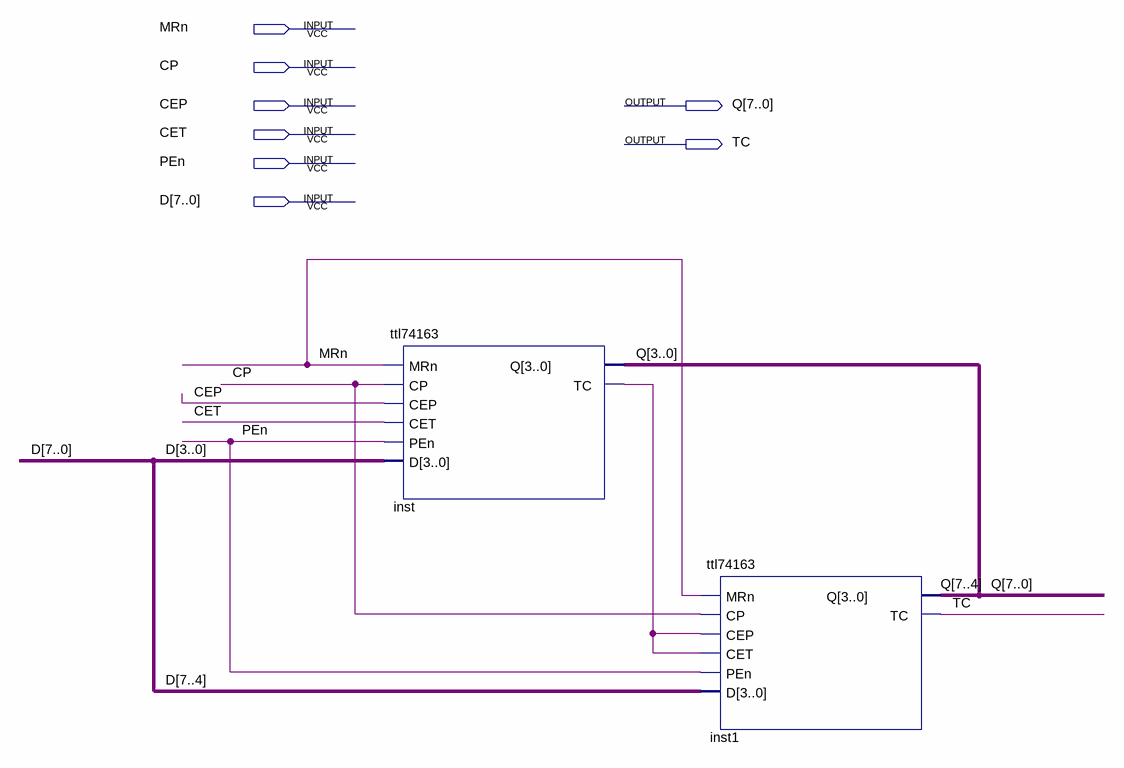
[diagram p0: schematic sheet]
// Quartus schematic bit8_counter.bdf as structural Verilog: 2 symbols, 8 pins
module bit8_counter (
  input  MRn,
  input  CP,
  input  CEP,
  input  CET,
  input  PEn,
  input  [7:0] D,
  output [7:0] Q,
  output TC
);

  wire inst_tc;

  ttl74163 inst (.MRn(MRn), .CP(CP), .CEP(CEP), .CET(CET), .PEn(PEn), .D(D[3:0]), .Q(Q[3:0]), .TC(inst_tc));
  ttl74163 inst1 (.MRn(MRn), .CP(CP), .CEP(inst_tc), .CET(inst_tc), .PEn(PEn), .D(D[7:4]), .Q(Q[7:4]), .TC(TC));
endmodule
